# EAGLE design mm_legend_v2 (EAGLE 7.2.0)
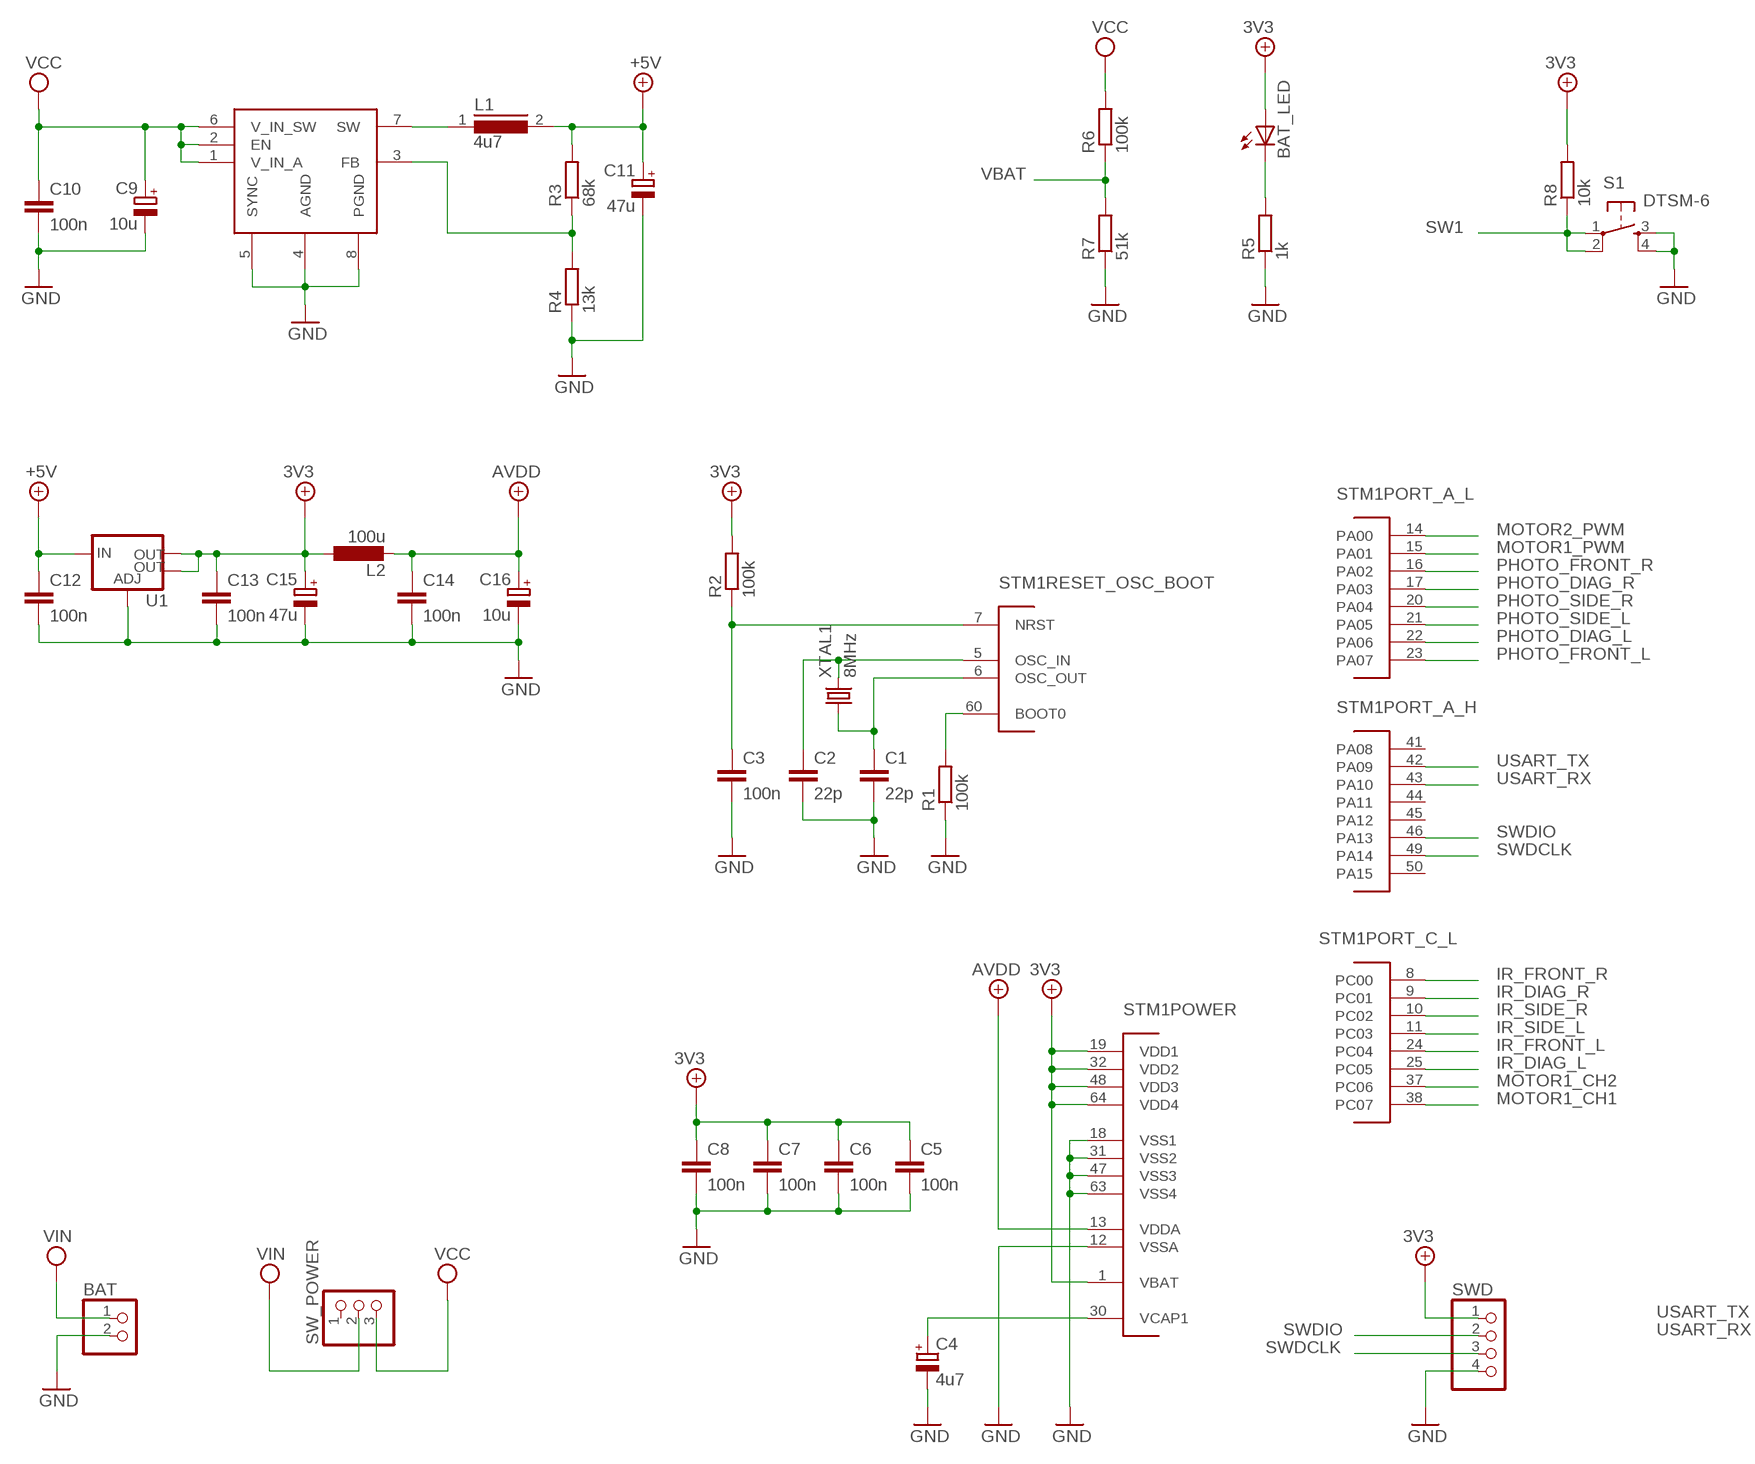
[diagram p0: schematic, sheet 1, part 1 of 2]
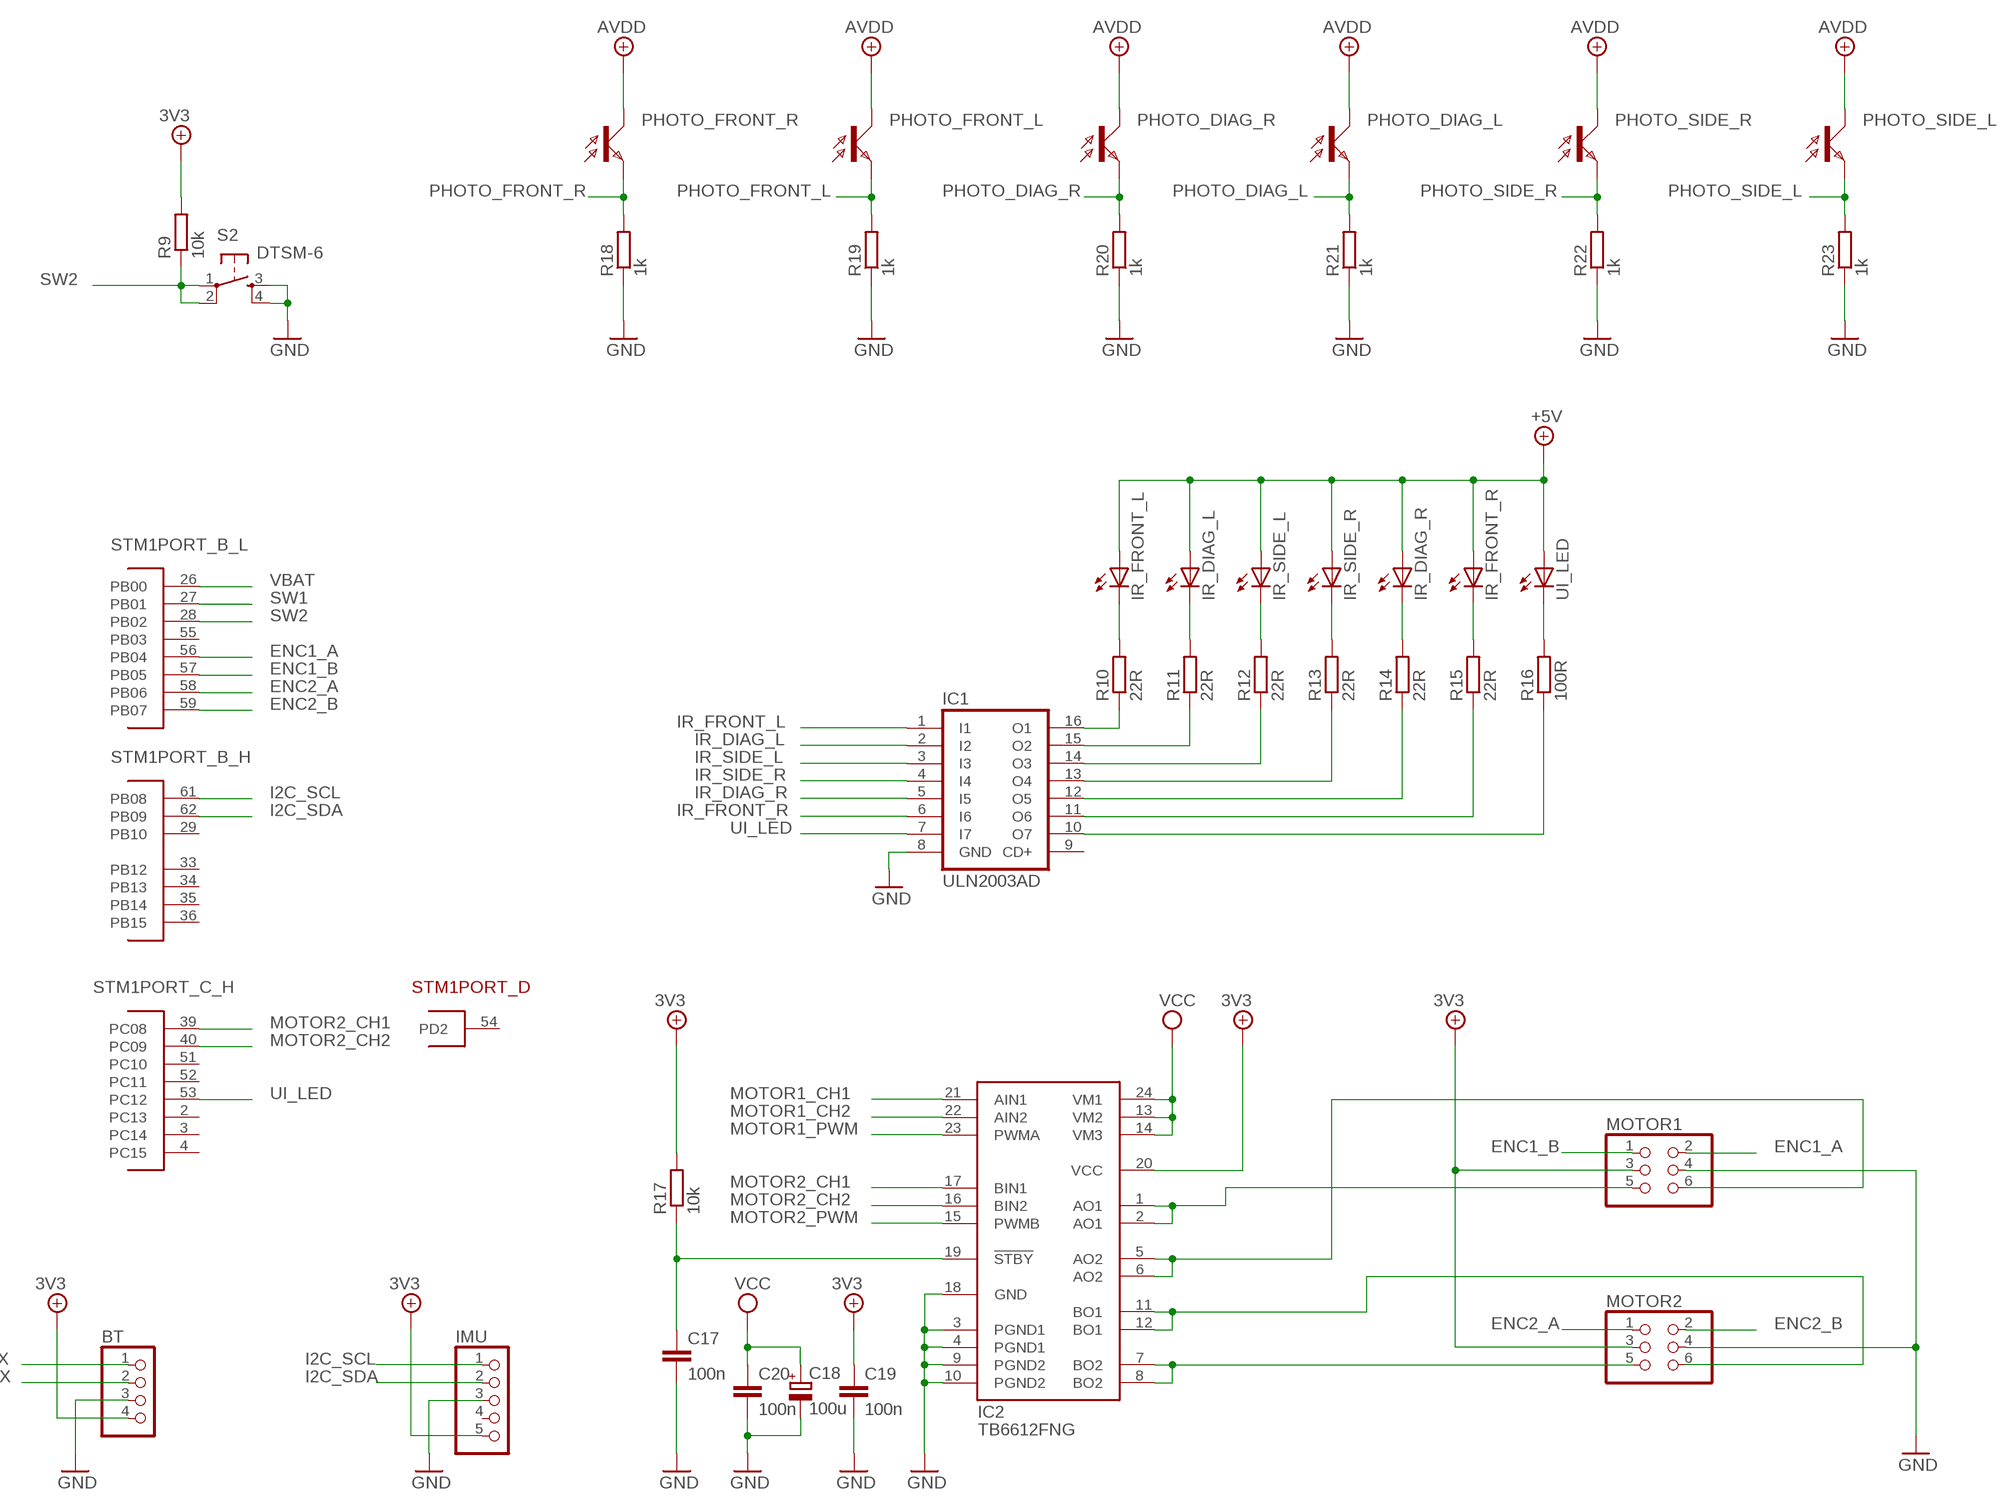
[diagram p1: schematic, sheet 1, part 2 of 2]

## Parts
BAT  PINHD-1X2  [1X02]
BAT_LED  LEDCHIP-LED0805  [CHIP-LED0805]
BT  PINHD-1X4  [1X04]
C1  22p  C-EUC0805K  [C0805K]
C2  22p  C-EUC0805K  [C0805K]
C3  100n  C-EUC0805K  [C0805K]
C4  4u7  CPOL-EUA/3216-18R  [A/3216-18R]
C5  100n  C-EUC0805K  [C0805K]
C6  100n  C-EUC0805K  [C0805K]
C7  100n  C-EUC0805K  [C0805K]
C8  100n  C-EUC0805K  [C0805K]
C9  10u  CPOL-EUA/3216-18R  [A/3216-18R]
C10  100n  C-EUC0805K  [C0805K]
C11  47u  CPOL-EUB/3528-21W  [B/3528-21W]
C12  100n  C-EUC0805K  [C0805K]
C13  100n  C-EUC0805K  [C0805K]
C14  100n  C-EUC0805K  [C0805K]
C15  47u  CPOL-EUB/3528-21W  [B/3528-21W]
C16  10u  CPOL-EUA/3216-18R  [A/3216-18R]
C17  100n  C-EUC0805K  [C0805K]
C18  100u  CPOL-EUC/6032-28R  [C/6032-28R]
C19  100n  C-EUC0805K  [C0805K]
C20  100n  C-EUC0805K  [C0805K]
IC1  ULN2003AD  [SO16]
IC2  TB6612FNG  [SSOP24]
IMU  PINHD-1X5  [1X05]
IR_DIAG_L  LED5MM  [LED5MM]
IR_DIAG_R  LED5MM  [LED5MM]
IR_FRONT_L  LED5MM  [LED5MM]
IR_FRONT_R  LED5MM  [LED5MM]
IR_SIDE_L  LED5MM  [LED5MM]
IR_SIDE_R  LED5MM  [LED5MM]
L1  4u7  DR74  [DR74]
L2  100u  L-EUL1812  [L1812]
MOTOR1  PINHD-2X3  [2X03]
MOTOR2  PINHD-2X3  [2X03]
PHOTO_DIAG_L  PHOTO_TRANSISTOR_5MM  [5MM]
PHOTO_DIAG_R  PHOTO_TRANSISTOR_5MM  [5MM]
PHOTO_FRONT_L  PHOTO_TRANSISTOR_5MM  [5MM]
PHOTO_FRONT_R  PHOTO_TRANSISTOR_5MM  [5MM]
PHOTO_SIDE_L  PHOTO_TRANSISTOR_5MM  [5MM]
PHOTO_SIDE_R  PHOTO_TRANSISTOR_5MM  [5MM]
R1  100k  R-EU_R0805W  [R0805W]
R2  100k  R-EU_R0805W  [R0805W]
R3  68k  R-EU_R0805W  [R0805W]
R4  13k  R-EU_R0805W  [R0805W]
R5  1k  R-EU_R0805W  [R0805W]
R6  100k  R-EU_R0805W  [R0805W]
R7  51k  R-EU_R0805W  [R0805W]
R8  10k  R-EU_R0805W  [R0805W]
R9  10k  R-EU_R0805W  [R0805W]
R10  22R  R-EU_R0805W  [R0805W]
R11  22R  R-EU_R0805W  [R0805W]
R12  22R  R-EU_R0805W  [R0805W]
R13  22R  R-EU_R0805W  [R0805W]
R14  22R  R-EU_R0805W  [R0805W]
R15  22R  R-EU_R0805W  [R0805W]
R16  100R  R-EU_R0805W  [R0805W]
R17  10k  R-EU_R0805W  [R0805W]
R18  1k  R-EU_R0805W  [R0805W]
R19  1k  R-EU_R0805W  [R0805W]
R20  1k  R-EU_R0805W  [R0805W]
R21  1k  R-EU_R0805W  [R0805W]
R22  1k  R-EU_R0805W  [R0805W]
R23  1k  R-EU_R0805W  [R0805W]
S1  DTSM-6  [DTSM-6]
S2  DTSM-6  [DTSM-6]
STM1  STM32F401RB  [LQFP64]
SW_POWER  PINHD-1X3  [1X03]
SWD  PINHD-1X4  [1X04]
U1  V_REG_LM1117SOT223  [SOT223]
U$2  ST1S10PHR  [SO8]
UI_LED  LEDCHIP-LED0805  [CHIP-LED0805]
XTAL1  8MHz  XTAL_SMD_50X32  [SMD_50X32]

## Nets
3V3: BAT_LED.A BT.4 C5.1 C6.1 C7.1 C8.1 C13.1 C15.+ C19.1 IC2.20(VCC) IMU.5 L2.1 MOTOR1.3 MOTOR2.3 R2.2 R8.2 R9.2 R17.2 STM1.1(POWER:VBAT) STM1.19(POWER:VDD1) STM1.32(POWER:VDD2) STM1.48(POWER:VDD3) STM1.64(POWER:VDD4) SWD.1 U1.2(OUT) U1.4(OUT)
+5V: C11.+ C12.1 IR_DIAG_L.A IR_DIAG_R.A IR_FRONT_L.A IR_FRONT_R.A IR_SIDE_L.A IR_SIDE_R.A L1.2 R3.2 U1.3(IN) UI_LED.A
AVDD: C14.1 C16.+ L2.2 PHOTO_DIAG_L.C PHOTO_DIAG_R.C PHOTO_FRONT_L.C PHOTO_FRONT_R.C PHOTO_SIDE_L.C PHOTO_SIDE_R.C STM1.13(POWER:VDDA)
ENC1_A: MOTOR1.2 STM1.56(PORT_B_L:PB04)
ENC1_B: MOTOR1.1 STM1.57(PORT_B_L:PB05)
ENC2_A: MOTOR2.1 STM1.58(PORT_B_L:PB06)
ENC2_B: MOTOR2.2 STM1.59(PORT_B_L:PB07)
GND: BAT.2 BT.3 C1.2 C2.2 C3.2 C4.- C5.2 C6.2 C7.2 C8.2 C9.- C10.2 C11.- C12.2 C13.2 C14.2 C15.- C16.- C17.2 C18.- C19.2 C20.2 IC1.8(GND) IC2.3(PGND1) IC2.4(PGND1) IC2.9(PGND2) IC2.10(PGND2) IC2.18(GND) IMU.3 MOTOR1.4 MOTOR2.4 R1.1 R4.1 R5.1 R7.1 R18.1 R19.1 R20.1 R21.1 R22.1 R23.1 S1.3 S1.4 S2.3 S2.4 STM1.12(POWER:VSSA) STM1.18(POWER:VSS1) STM1.31(POWER:VSS2) STM1.47(POWER:VSS3) STM1.63(POWER:VSS4) SWD.4 U1.1(ADJ) U$2.4(AGND) U$2.5(SYNC) U$2.8(PGND)
I2C_SCL: IMU.1 STM1.61(PORT_B_H:PB08)
I2C_SDA: IMU.2 STM1.62(PORT_B_H:PB09)
IR_DIAG_L: IC1.2(I2) STM1.25(PORT_C_L:PC05)
IR_DIAG_R: IC1.5(I5) STM1.9(PORT_C_L:PC01)
IR_FRONT_L: IC1.1(I1) STM1.24(PORT_C_L:PC04)
IR_FRONT_R: IC1.6(I6) STM1.8(PORT_C_L:PC00)
IR_SIDE_L: IC1.3(I3) STM1.11(PORT_C_L:PC03)
IR_SIDE_R: IC1.4(I4) STM1.10(PORT_C_L:PC02)
MOTOR1_CH1: IC2.21(AIN1) STM1.38(PORT_C_L:PC07)
MOTOR1_CH2: IC2.22(AIN2) STM1.37(PORT_C_L:PC06)
MOTOR1_PWM: IC2.23(PWMA) STM1.15(PORT_A_L:PA01)
MOTOR2_CH1: IC2.17(BIN1) STM1.39(PORT_C_H:PC08)
MOTOR2_CH2: IC2.16(BIN2) STM1.40(PORT_C_H:PC09)
MOTOR2_PWM: IC2.15(PWMB) STM1.14(PORT_A_L:PA00)
N$1: R1.2 STM1.60(RESET_OSC_BOOT:BOOT0)
N$2: C3.1 R2.1 STM1.7(RESET_OSC_BOOT:NRST)
N$3: C1.1 STM1.6(RESET_OSC_BOOT:OSC_OUT) XTAL1.1
N$4: C2.1 STM1.5(RESET_OSC_BOOT:OSC_IN) XTAL1.2
N$5: BAT_LED.C R5.2
N$6: C17.1 IC2.19(!STBY) R17.1
N$7: R16.2 UI_LED.C
N$8: IR_FRONT_L.K(C) R10.2
N$9: C4.+ STM1.30(POWER:VCAP1)
N$10: IR_DIAG_L.K(C) R11.2
N$11: IR_SIDE_L.K(C) R12.2
N$12: IR_SIDE_R.K(C) R13.2
N$13: IR_DIAG_R.K(C) R14.2
N$14: IR_FRONT_R.K(C) R15.2
N$15: IC1.16(O1) R10.1
N$16: IC1.15(O2) R11.1
N$17: IC1.14(O3) R12.1
N$18: IC1.13(O4) R13.1
N$19: IC1.12(O5) R14.1
N$20: IC1.11(O6) R15.1
N$21: IC1.10(O7) R16.1
N$22: L1.1 U$2.7(SW)
N$23: IC2.1(AO1) IC2.2(AO1) MOTOR1.5
N$24: IC2.5(AO2) IC2.6(AO2) MOTOR1.6
N$25: R3.1 R4.2 U$2.3(FB)
N$28: IC2.11(BO1) IC2.12(BO1) MOTOR2.6
N$30: IC2.7(BO2) IC2.8(BO2) MOTOR2.5
PHOTO_DIAG_L: PHOTO_DIAG_L.E R21.2 STM1.22(PORT_A_L:PA06)
PHOTO_DIAG_R: PHOTO_DIAG_R.E R20.2 STM1.17(PORT_A_L:PA03)
PHOTO_FRONT_L: PHOTO_FRONT_L.E R19.2 STM1.23(PORT_A_L:PA07)
PHOTO_FRONT_R: PHOTO_FRONT_R.E R18.2 STM1.16(PORT_A_L:PA02)
PHOTO_SIDE_L: PHOTO_SIDE_L.E R23.2 STM1.21(PORT_A_L:PA05)
PHOTO_SIDE_R: PHOTO_SIDE_R.E R22.2 STM1.20(PORT_A_L:PA04)
SW1: R8.1 S1.1 S1.2 STM1.27(PORT_B_L:PB01)
SW2: R9.1 S2.1 S2.2 STM1.28(PORT_B_L:PB02)
SWDCLK: STM1.49(PORT_A_H:PA14) SWD.3
SWDIO: STM1.46(PORT_A_H:PA13) SWD.2
UI_LED: IC1.7(I7) STM1.53(PORT_C_H:PC12)
USART_RX: BT.2 STM1.43(PORT_A_H:PA10)
USART_TX: BT.1 STM1.42(PORT_A_H:PA09)
VBAT: R6.1 R7.2 STM1.26(PORT_B_L:PB00)
VCC: C9.+ C10.1 C18.+ C20.1 IC2.13(VM2) IC2.14(VM3) IC2.24(VM1) R6.2 SW_POWER.3 U$2.1(V_IN_A) U$2.2(EN) U$2.6(V_IN_SW)
VEE: BAT.1 SW_POWER.2 ; supply symbol labelled VIN
Unconnected: IC1.9(CD+) IMU.4 STM1.2(PORT_C_H:PC13) STM1.3(PORT_C_H:PC14) STM1.4(PORT_C_H:PC15) STM1.29(PORT_B_H:PB10) STM1.33(PORT_B_H:PB12) STM1.34(PORT_B_H:PB13) STM1.35(PORT_B_H:PB14) STM1.36(PORT_B_H:PB15) STM1.41(PORT_A_H:PA08) STM1.44(PORT_A_H:PA11) STM1.45(PORT_A_H:PA12) STM1.50(PORT_A_H:PA15) STM1.51(PORT_C_H:PC10) STM1.52(PORT_C_H:PC11) STM1.54(PORT_D:PD2) STM1.55(PORT_B_L:PB03) SW_POWER.1

## Library data of the parts
BAT = pinhead:PINHD-1X2: PIN HEADER
BAT_LED IR_DIAG_L IR_DIAG_R IR_FRONT_L IR_FRONT_R IR_SIDE_L IR_SIDE_R UI_LED = led:LED: LED OSRAM: - CHIPLED LG R971, LG N971, LY N971, LG Q971, LY Q971, LO R971, LY R971 LH N974, LH R974 LS Q976, LO Q976, LY Q976 LO Q996 - Hyper CHIPLED LW Q18S LB Q993, LB Q99A, LB R99A - SideLED LS A670, LO A670, LY A670, LG A670, LP A670 LB A673, LV A673, LT A673, LW A673 LH A674 LY A675 LS A676, LA A676, LO A676, LY A676, LW A676 LS A679, LY A679, LG A679 - Hyper Micro SIDELED® LS Y876, LA Y876, LO Y876, LY Y876 LT Y87S - SmartLED LW L88C, LW L88S LB L89C, LB L89S, LG L890 LS L89K, LO L89K, LY L89K LS L896, LA L896, LO L896, LY L896 - TOPLED LS T670, LO T670, LY T670, LG T670, LP T670 LSG T670, LSP T670, LSY T670, LOP T670, LYG T670 LG T671, LOG T671, LSG T671 LB T673, LV T673, LT T673, LW T673 LH T674 LS T676, LA T676, LO T676, LY T676, LB T676, LH T676, LSB T676, LW T676 LB T67C, LV T67C, LT T67C, LS T67K, LO T67K, LY T67K, LW E67C LS E67B, LA E67B, LO E67B, LY E67B, LB E67C, LV E67C, LT E67C LW T67C LS T679, LY T679, LG T679 LS T770, LO T770, LY T770, LG T770, LP T770 LB T773, LV T773, LT T773, LW T773 LH T774 LS E675, LA E675, LY E675, LS T675 LS T776, LA T776, LO T776, LY T776, LB T776 LHGB T686 LT T68C, LB T68C - Hyper Mini TOPLED® LB M676 - Mini TOPLED Santana® LG M470 LS M47K, LO M47K, LY M47K Source: http://www.osram.convergy.de LUXEON: - LUMILED® LXK2-PW12-R00, LXK2-PW12-S00, LXK2-PW14-U00, LXK2-PW14-V00 LXK2-PM12-R00, LXK2-PM12-S00, LXK2-PM14-U00 LXK2-PE12-Q00, LXK2-PE12-R00, LXK2-PE12-S00, LXK2-PE14-T00, LXK2-PE14-U00 LXK2-PB12-K00, LXK2-PB12-L00, LXK2-PB12-M00, LXK2-PB14-N00, LXK2-PB14-P00, LXK2-PB14-Q00 LXK2-PR12-L00, LXK2-PR12-M00, LXK2-PR14-Q00, LXK2-PR14-R00 LXK2-PD12-Q00, LXK2-PD12-R00, LXK2-PD12-S00 LXK2-PH12-R00, LXK2-PH12-S00 LXK2-PL12-P00, LXK2-PL12-Q00, LXK2-PL12-R00 Source: www.luxeon.com KINGBRIGHT: KA-3528ASYC Source: www.kingbright.com
BT SWD = pinhead:PINHD-1X4: PIN HEADER
C1-C3 C5-C8 C10 C12-C14 C17 C19 C20 = resistor:C-EU: CAPACITOR, European symbol
C4 C9 C11 C15 C16 C18 = resistor:CPOL-EU: POLARIZED CAPACITOR, European symbol
IC1 = uln-udn:ULN2003A: DRIVER ARRAY
IC2 = tb6612:TB6612FNG
IMU = pinhead:PINHD-1X5: PIN HEADER
L1 = inductors:DR74: High Power Density, High Efficiency, Shielded Inductors Source: coiltronics_dr_series.pdf
L2 = resistor:L-EU: INDUCTOR, European symbol
MOTOR1 MOTOR2 = pinhead:PINHD-2X3: PIN HEADER
PHOTO_DIAG_L PHOTO_DIAG_R PHOTO_FRONT_L PHOTO_FRONT_R PHOTO_SIDE_L PHOTO_SIDE_R = photo_transistor_5mm:PHOTO_TRANSISTOR_5MM
R1-R23 = resistor:R-EU_: RESISTOR, European symbol
S1 S2 = switch-tact:DTSM-6
STM1 = stm32f4:STM32F401RB: STM32F401RB STM32F4 MCU with Cortex-M4 core and FPU, 128kB Flash, 64kB RAM, max clock frequency 84MHz Features: 7x General purpose timer 1x Advanced control timer 3x SPI 2x I2S 3x I2C 3x USART 1x SDIO 1x USB OTG 1x ADC Data sheet <http://www.st.com/st-web-ui/static/active/en/resource/technical/document/datasheet/DM00086815.pdf>
SW_POWER = pinhead:PINHD-1X3: PIN HEADER
U1 = SparkFun-PowerIC:V_REG_LM1117: Voltage Regulator LM1117 Standard adjustable voltage regulator but in SMD form. Spark Fun Electronics SKU : COM-00595; PROD_ID: VREG-08170
U$2 = ST1S10PHR:ST1S10PHR: ST1S10 - SO8: 3 A, 900 kHz, monolithic synchronous step-down regulator
XTAL1 = xtal_smd:XTAL_SMD_50X32

## Board
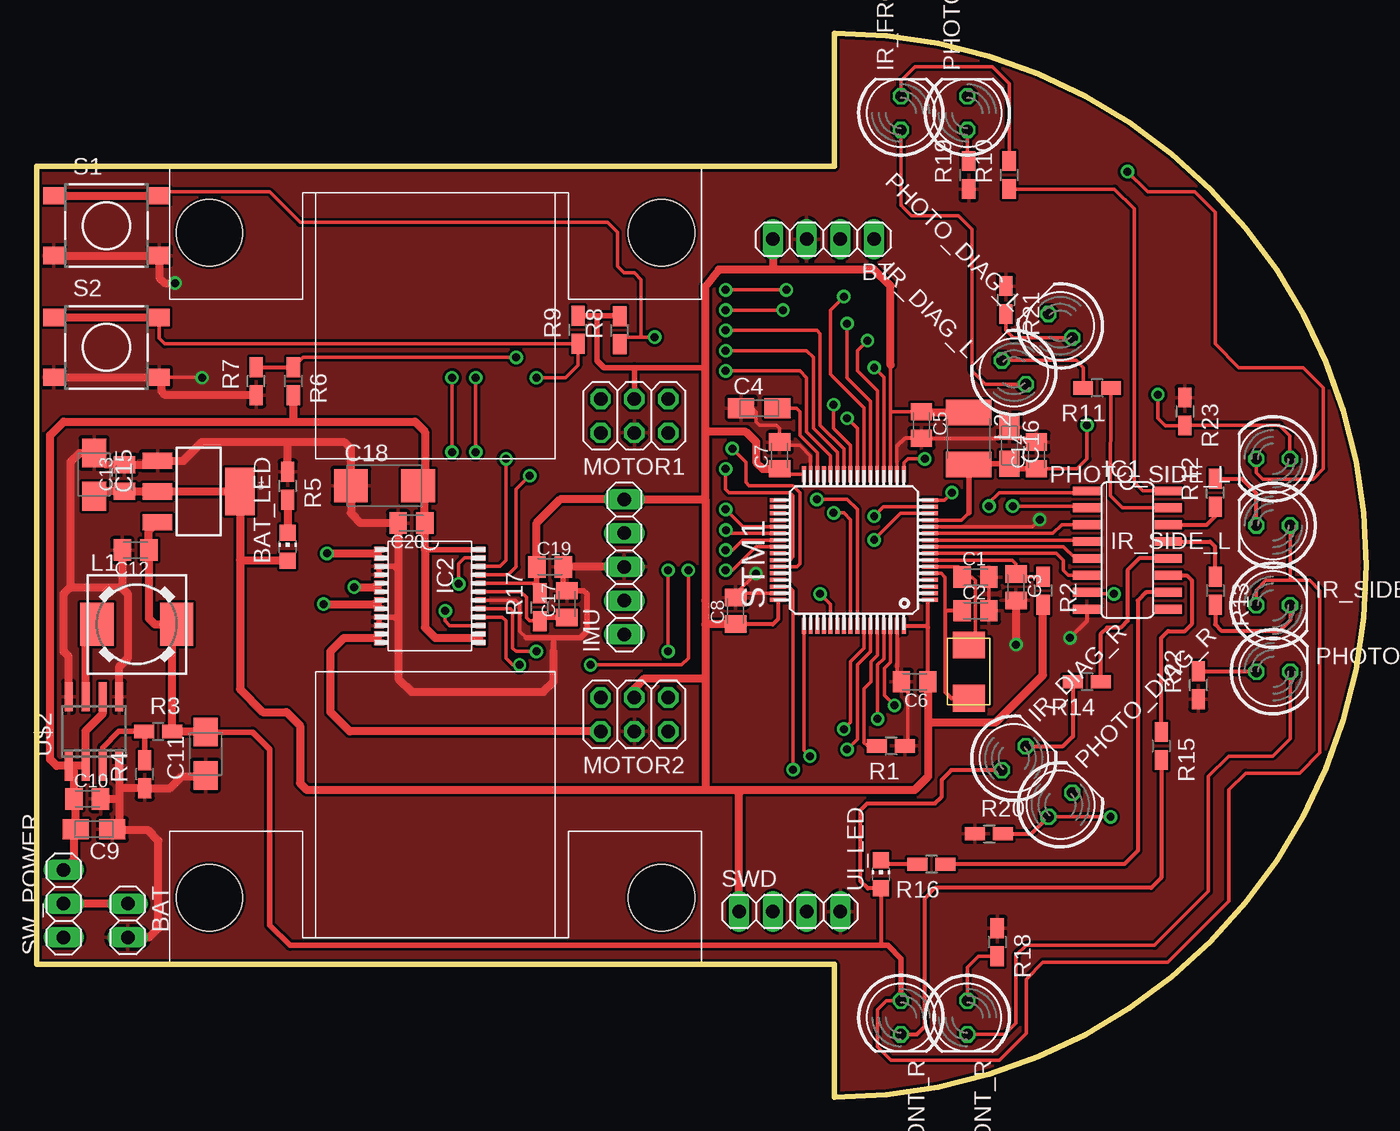
[diagram p2: board, top side]
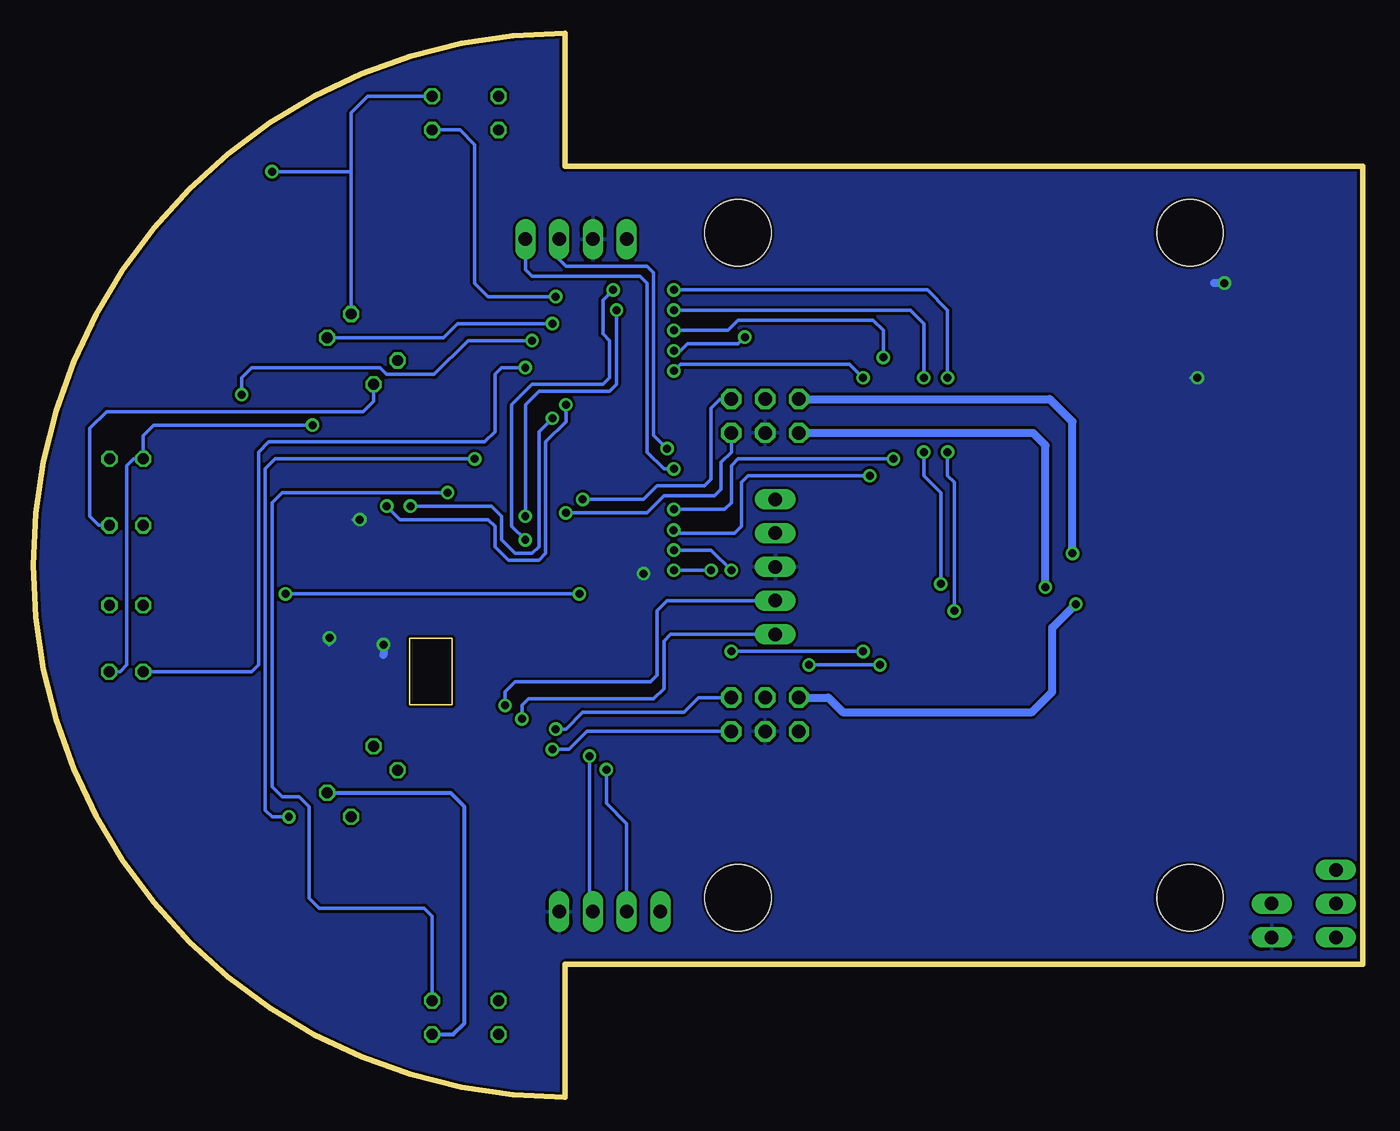
[diagram p3: board, bottom side, seen from below]

Size 100 x 80 mm. Coordinates in mm from the lower left corner, seen from the top.
Outline: 0,10 60,10 60,0 arc180 60,80 60,70 0,70 0,10
Copper layers (1*16): Top 0.035mm / dielectric 1.5mm / Bottom 0.035mm
Design rules "satland": minimum track width 8mil, minimum drill 0.3mm, track to track 8mil, track to pad 8mil, pad to pad 8mil, via to via 8mil, smd to smd 8mil, copper to edge 8mil, drill to drill 8mil, minimum pad ring 8mil, minimum via ring 8mil, stop-mask expansion 4mil, vias tented up to drill 0mil, thermal gap 10mil

### Footprints (pad centres in the part's own frame; a part is rotated, then mirrored left to right if it is on the bottom)
1X02 = drill 1.016 long: 1 -1.27,0; 2 1.27,0
CHIP-LED0805 = smd 1.2 x 1.2: A 0,-1.05; C 0,1.05
1X04 = drill 1.016 long: 1 -3.81,0; 2 -1.27,0; 3 1.27,0; 4 3.81,0
C0805K = smd 1.3 x 1.6: 1 -1,0; 2 1,0
A/3216-18R = smd 1.95 x 1.5: + 1.375,0; - -1.375,0
B/3528-21W = smd 2.15 x 1.8: + 1.625,0; - -1.625,0
C/6032-28R = smd 2.55 x 2.5: + 2.525,0; - -2.525,0
SO16 = smd 0.66 x 2.032: 1 -4.445,-3.073; 2 -3.175,-3.073; 3 -1.905,-3.073; 4 -0.635,-3.073; 5 0.635,-3.073; 6 1.905,-3.073; 7 3.175,-3.073; 8 4.445,-3.073; 9 4.445,3.073; 10 3.175,3.073; 11 1.905,3.073; 12 0.635,3.073; 13 -0.635,3.073; 14 -1.905,3.073; 15 -3.175,3.073; 16 -4.445,3.073
SSOP24 = smd 0.406 x 0.762: 1 -3.651,-3.81; 2 -3.016,-3.81; 3 -2.381,-3.81; 4 -1.746,-3.81; 5 -1.111,-3.81; 6 -0.476,-3.81; 7 0.159,-3.81; 8 0.794,-3.81; 9 1.429,-3.81; 10 2.064,-3.81; 11 2.699,-3.81; 12 3.334,-3.81; 13 3.334,3.81; 14 2.699,3.81; 15 2.064,3.81; 16 1.429,3.81; 17 0.794,3.81; 18 0.159,3.81; 19 -0.476,3.81; 20 -1.111,3.81; 21 -1.746,3.81; 22 -2.381,3.81; 23 -3.016,3.81; 24 -3.651,3.81
1X05 = drill 1.016 long: 1 -5.08,0; 2 -2.54,0; 3 0,0; 4 2.54,0; 5 5.08,0
LED5MM = drill 0.813 octagon: A -1.27,0; K 1.27,0
DR74 = smd 2.5 x 3.25: 1 -3,0; 2 3,0
L1812 = smd 1.9 x 3.4: 1 -1.95,0; 2 1.95,0
2X03 = drill 1.016 octagon: 1 -2.54,-1.27; 2 -2.54,1.27; 3 0,-1.27; 4 0,1.27; 5 2.54,-1.27; 6 2.54,1.27
5MM = drill 0.813 octagon: C 1.27,0; E -1.27,0
R0805W = smd 1.5 x 1: 1 -1.052,0; 2 1.052,0
DTSM-6 = smd 1.55 x 1.3: 1 -3.975,2.25; 2 3.975,2.25; 3 -3.975,-2.25; 4 3.975,-2.25
LQFP64 = smd 0.3 x 1.2: 1 -3.75,-5.7; 2 -3.25,-5.7; 3 -2.75,-5.7; 4 -2.25,-5.7; 5 -1.75,-5.7; 6 -1.25,-5.7; 7 -0.75,-5.7; 8 -0.25,-5.7; 9 0.25,-5.7; 10 0.75,-5.7; 11 1.25,-5.7; 12 1.75,-5.7; 13 2.25,-5.7; 14 2.75,-5.7; 15 3.25,-5.7; 16 3.75,-5.7; 33 3.75,5.7; 34 3.25,5.7; 35 2.75,5.7; 36 2.25,5.7; 37 1.75,5.7; 38 1.25,5.7; 39 0.75,5.7; 40 0.25,5.7; 41 -0.25,5.7; 42 -0.75,5.7; 43 -1.25,5.7; 44 -1.75,5.7; 45 -2.25,5.7; 46 -2.75,5.7; 47 -3.25,5.7; 48 -3.75,5.7 | smd 1.2 x 0.3: 17 5.7,-3.75; 18 5.7,-3.25; 19 5.7,-2.75; 20 5.7,-2.25; 21 5.7,-1.75; 22 5.7,-1.25; 23 5.7,-0.75; 24 5.7,-0.25; 25 5.7,0.25; 26 5.7,0.75; 27 5.7,1.25; 28 5.7,1.75; 29 5.7,2.25; 30 5.7,2.75; 31 5.7,3.25; 32 5.7,3.75; 49 -5.7,3.75; 50 -5.7,3.25; 51 -5.7,2.75; 52 -5.7,2.25; 53 -5.7,1.75; 54 -5.7,1.25; 55 -5.7,0.75; 56 -5.7,0.25; 57 -5.7,-0.25; 58 -5.7,-0.75; 59 -5.7,-1.25; 60 -5.7,-1.75; 61 -5.7,-2.25; 62 -5.7,-2.75; 63 -5.7,-3.25; 64 -5.7,-3.75
1X03 = drill 1.016 long: 1 -2.54,0; 2 0,0; 3 2.54,0
SOT223 = smd 1.219 x 2.235: 1 -2.311,-3.099; 2 0,-3.099; 3 2.311,-3.099 | smd 3.6 x 2.2: 4 0,3.099
MOTOR_HOLDER = hole 5: -17,5; 17,5
SO8 = smd 0.6 x 2.2: 1 -1.905,-2.6; 2 -0.635,-2.6; 3 0.635,-2.6; 4 1.905,-2.6; 5 1.905,2.6; 6 0.635,2.6; 7 -0.635,2.6; 8 -1.905,2.6
SMD_50X32 = smd 2 x 2.4: 1 -2,0; 2 2,0

### Placement (x,y rotation side)
BAT  6.86,13.29 270 top
BAT_LED  18.88,41.4 0 top
BT  59.18,64.52 180 top
C1  70.61,39.12 0 top
C2  70.61,36.58 0 top
C3  73.66,38.35 270 top
C4  54.36,51.82 0 top
C5  66.55,50.55 270 top
C6  66.04,31.24 180 top
C7  55.88,48.26 90 top
C8  52.58,36.58 90 top
C9  4.32,20.15 180 top
C10  3.81,22.43 0 top
C11  12.7,25.83 90 top
C12  7.45,41.15 180 top
C13  6.6,46.56 90 top
C14  75.18,48.26 90 top
C15  4.32,46.82 270 top
C16  73.15,49.02 270 top
C17  39.88,37.08 90 top
C18  26.16,45.97 0 top
C19  38.61,39.88 0 top
C20  28.19,43.18 180 top
IC1  82.04,41.15 270 top
IC2  29.58,37.54 270 top
IMU  44.2,39.88 90 top
IR_DIAG_L  73.5,54.5 135 top
IR_DIAG_R  73.5,25.5 45 top
IR_FRONT_L  65,74 90 top
IR_FRONT_R  65,6 270 top
IR_SIDE_L  93,43 180 top
IR_SIDE_R  93,37 0 top
L1  7.54,35.56 0 top
L2  70.1,49.53 270 top
MOTOR1  44.96,51.23 180 top
MOTOR2  44.96,28.78 180 top
PHOTO_DIAG_L  76.99,58 135 top
PHOTO_DIAG_R  77,22 45 top
PHOTO_FRONT_L  70,74 90 top
PHOTO_FRONT_R  70,6 270 top
PHOTO_SIDE_L  92.99,48 180 top
PHOTO_SIDE_R  93.01,32 0 top
R1  64.26,26.42 180 top
R2  75.69,38.1 270 top
R3  9.14,27.51 0 top
R4  8.13,24.3 90 top
R5  18.88,45.97 270 top
R6  19.3,53.85 270 top
R7  16.51,53.85 90 top
R8  43.86,57.66 90 top
R9  40.71,57.71 90 top
R10  73.15,69.34 90 top
R11  79.76,53.34 180 top
R12  88.65,45.47 90 top
R13  88.65,38.1 270 top
R14  78.99,31.24 180 top
R15  84.58,26.42 270 top
R16  67.31,17.53 180 top
R17  37.85,36.83 90 top
R18  72.25,11.67 270 top
R19  70.1,69.34 90 top
R20  71.63,19.81 0 top
R21  72.9,59.94 270 top
R22  87.38,30.99 90 top
R23  86.36,51.56 270 top
S1  5.25,65.53 0 top
S2  5.25,56.39 0 top
STM1  61.47,41.15 90 top
SW_POWER  2.03,14.56 90 top
SWD  56.64,13.97 0 top
U1  12.19,45.55 270 top
U$1  [MOTOR_HOLDER]  30,10 0 top
U$2  4.32,27.51 0 top
U$3  [MOTOR_HOLDER]  30,70 180 top
UI_LED  63.5,16.76 0 top
XTAL1  70.1,32 270 top

### Tracks (layer width: path | path; a pad name or v marks a point on that pad's centre or on a via)
3V3
  Top 0.254: IC2.20 37.57,38.65 | STM1.32 56.29,46.85 C7.1 | STM1.19 64.22,51.56 | 64.22,51.56 64.22,55.07 | C5.1 64.23,51.55 64.22,51.56
  Top 0.305: 50.35,37.4 50.29,37.34 | C6.1 67.04,35.31 | 67.04,35.31 67.04,37.27 STM1.1 | STM1.64 66.9,35.45 67.04,35.31 | STM1.48 55.77,35.96 55.37,35.56 52.59,35.56 C8.1
  Top 0.406: C19.1 37.61,38.61 | 37.61,38.61 37.61,38.12 R17.2 | 37.57,38.65 37.61,38.61 | 43.81,58.76 R8.2 43.86,58.76 42.16,58.76 | R9.2 42.16,58.76 | 42.16,58.76 42.16,55.37 42.67,54.86 44.96,54.86 | 44.96,54.86 50.29,54.86 | MOTOR1.3 44.96,54.86
  Top 0.61: C15.+ 4.69,45.56 C13.1 9.08,45.56 U1.2 U1.4 15.29,40.39 | 15.29,40.39 15.29,30.68 17.02,28.96 18.8,28.96 19.81,27.94 19.81,23.62 20.32,23.11 50.29,23.11 | 50.29,23.11 52.58,23.11 | 52.58,23.11 66.04,23.11 67.04,24.11 67.04,28.19 | 50.29,44.96 50.29,37.34 50.29,35.56 | 50.29,35.56 50.29,31.5 | 50.29,31.5 50.29,23.11 | 50.29,44.96 IMU.5 39.37,44.96 37.61,43.2 C19.1 | C6.1 67.04,28.19 | L2.1 66.61,51.48 C5.1 | SWD.1 52.83,22.86 52.58,23.11 | 52.59,35.56 50.29,35.56 | 64.22,55.07 64.22,61 62.99,62.23 55.37,62.23 | 55.37,62.23 51.31,62.23 50.29,60.96 50.29,54.86 50.29,50.04 | 50.29,44.96 50.29,50.04 | 50.29,50.04 53.34,50.04 54.1,49.28 54.1,47.75 54.61,47.24 55.86,47.24 C7.1 | BAT_LED.A 15.32,40.35 15.29,40.39 | BT.4 55.37,62.23 | MOTOR2.3 44.96,30.73 45.72,31.5 50.29,31.5 | 67.04,28.19 72.14,28.19 75.69,31.75 R2.2
+5V
  Top 0.254: IR_SIDE_R.A 91.73,38.14 92.46,38.86 94.23,38.86 | 94.23,38.86 95.76,38.86 96.52,38.1 96.52,25.91 95,24.38 90.93,24.38 89.66,23.11 89.66,14.73 85.09,10.16 75.69,10.16 74.42,8.89 74.42,4.83 72.39,2.79 64.26,2.79 63.25,3.81 63.25,6.6 63.91,7.27 IR_FRONT_R.A | IR_SIDE_L.A 94.27,38.9 94.23,38.86 | IR_DIAG_L.A 71.37,53.6 70.36,54.61 70.36,65.28 69.34,66.29 65.79,66.29 65.15,66.93 65.02,67.06 65,67.08 IR_FRONT_L.A
  Top 0.305: 63.5,11.43 UI_LED.A 62.52,15.71 61.98,16.26 61.98,21.59 62.48,22.1 67.56,22.1 68.07,22.61 68.07,23.88 68.8,24.6 IR_DIAG_R.A
  Top 0.406: C11.+ 16.23,27.45 17.53,26.16 17.53,12.95 19.05,11.43 63.5,11.43 64.01,11.43 65,10.44 IR_FRONT_R.A
  Top 0.61: U1.3 8.45,42.59 C12.1 8.45,36 8.89,35.56 L1.2 10.2,35.22 R3.2 12.64,27.51 C11.+
  Bottom 0.254: IR_SIDE_L.A 95.07,43 95.76,43.69 95.76,50.29 94.49,51.56 75.18,51.56 74.4,52.35 IR_DIAG_L.A
AVDD  (via drill 0.6)
  Top 0.254: STM1.13 69.56,43.4 70.1,43.94 | 74.68,47.26 74.69,47.24 78.23,47.24 78.99,48 v78.99,50.54 v78.99,50.55 | PHOTO_SIDE_R.C 94.28,26.97 92.96,25.65 89.66,25.65 88.14,24.13 88.14,15.49 84.07,11.43 74.42,11.43 73.66,10.67 73.66,5.59 72.8,4.73 PHOTO_FRONT_R.C | PHOTO_SIDE_L.C 91.72,46.96 92.2,46.48 96.01,46.48 96.77,47.24 96.77,53.34 95.25,54.86 90.42,54.86 88.65,56.64 88.65,66.55 87.12,68.07 83.57,68.07 v82.04,69.6
  Top 0.406: 70.1,43.94 L2.2 70.17,47.65 C16.+ 73.54,47.26 74.68,47.26 C14.1
  Bottom 0.254: v78.99,50.55 90.93,50.55 91.72,49.76 PHOTO_SIDE_L.C 92.46,48 92.96,47.5 92.96,32.51 93.47,32 PHOTO_SIDE_R.C | PHOTO_DIAG_L.C 76.09,69.6 | 76.09,69.6 76.09,74.02 74.84,75.27 PHOTO_FRONT_L.C | v82.04,69.6 76.09,69.6
  Bottom 0.305: PHOTO_FRONT_R.C 68.42,4.73 67.56,5.59 67.56,21.84 68.62,22.9 PHOTO_DIAG_R.C
ENC1_A  (via drill 0.6 pad 0.3)
  Top 0.254: STM1.56 61.22,43.43 60.71,43.94 v59.94,43.94
  Bottom 0.254: v59.94,43.94 53.85,43.94 52.58,45.21 48.77,45.21 48.26,45.72 48.26,47.75 47.5,48.51 MOTOR1.2
ENC1_B  (via drill 0.6 pad 0.3)
  Top 0.254: STM1.57 61.72,44.2 60.96,44.96 v58.67,44.96
  Bottom 0.254: v58.67,44.96 54.1,44.96 53.09,45.97 49.53,45.97 49.02,46.48 49.02,51.82 48.34,52.5 MOTOR1.1
ENC2_A  (via drill 0.6 pad 0.3)
  Top 0.254: STM1.58 62.22,33.77 61.21,32.77 61.21,28.19 v60.71,27.69
  Bottom 0.254: v60.71,27.69 59.94,27.69 58.67,28.96 51.05,28.96 49.96,30.05 MOTOR2.1
ENC2_B  (via drill 0.6 pad 0.3)
  Top 0.254: STM1.59 62.72,33.51 61.72,32.51 61.72,26.92 v60.96,26.16
  Bottom 0.254: v60.96,26.16 59.69,26.16 58.34,27.51 MOTOR2.2
GND  (via drill 0.6, 0.6 pad 0.3)
  Top 0.254: C1.2 71.61,37.34 | 71.61,37.34 C2.2 | 71.63,37.35 71.61,37.34 | 36.83,34.54 36.32,35.05 36.32,37.08 36.03,37.38 IC2.18 | STM1.12 74.9,42.9 v75.44,43.43 | STM1.31 58.22,48.21 57.4,49.02 56.12,49.02 C7.2 55.88,50.29 55.63,50.55 54.36,50.55 54.1,50.8 54.1,51.56 53.85,51.82 C4.- | C6.2 65.28,31.24 65.53,30.99 65.53,26.63 R1.1 | STM1.18 64.72,48.97 | v12.45,54.1 12.41,54.14 S2.4 | STM1.47 52.9,37.9 | C8.2 52.58,37.85 v54.1,39.37
  Top 0.305: STM1.63 64.72,31.56 C6.2 | 52.9,37.9 C8.2 | 64.72,48.97 65.29,49.55 C5.2 72.3,49.55 C16.- 73.15,49.78 73.41,49.53 74.93,49.53 75.18,49.28 C14.2 | IC1.8 78.97,35.79 v77.72,34.54
  Top 0.406: C19.2 39.61,38.35 C17.2 39.89,38.1 41.15,38.1 41.4,37.85 41.4,35.05 40.89,34.54 38.86,34.54 | 38.86,33.53 38.86,34.54 | IC2.4 IC2.3 26.9,39.92 27.19,39.62 | IC2.10 IC2.9 26.9,36.11 27.19,35.81 | 38.86,34.54 36.83,34.54
  Top 0.61: U$2.4 6.22,23.11 | 6.22,23.11 6.22,22.35 | 6.22,22.35 6.22,20.68 C9.- 5.77,20.07 8.38,20.07 9.14,19.3 9.14,12.7 8.46,12.02 BAT.2 | C10.2 6.14,22.43 6.22,22.35 | 6.22,23.11 6.36,23.25 R4.1 10.04,23.25 10.92,24.13 12.63,24.13 C11.- | U$2.8 2.41,33.15 2.03,33.53 2.03,37.85 2.54,38.35 | 2.54,38.35 6.35,38.35 | 6.35,38.35 6.86,37.85 6.86,33.02 6.22,32.38 U$2.5 | 2.54,38.35 2.54,47.75 3.23,48.44 C15.- 5.2,47.56 C13.2 8.8,47.56 U1.1 11.03,47.86 12.45,49.28 18.8,49.28 | C12.2 6.45,38.45 6.35,38.35 | 38.86,33.53 38.86,31.24 38.1,30.48 28.19,30.48 27.19,31.48 27.19,35.81 27.19,39.62 C20.2 24.38,43.18 23.64,43.93 C18.- 23.62,45.99 23.62,48.77 23.11,49.28 18.8,49.28 | IMU.3 C19.2 | R5.1 18.88,49.2 18.8,49.28 | S2.3 S2.4 9.4,53.97 9.4,53.09 9.69,52.8 R7.1 | S1.3 S1.4 9.23,61.64 9.65,61.21 v10.41,61.21 | C3.2 v73.66,34.04
  Bottom 0.254: v75.44,43.43 75.95,43.43 | v12.45,54.1 12.95,54.1 | v54.1,39.37 54.1,39.62
  Bottom 0.305: v77.72,34.54 77.72,34.04
  Bottom 0.61: v10.41,61.21 11.18,61.21 | v73.66,34.04 73.66,33.27
  pour Top: 0,0 0,80.01 100.08,80.01 100.08,0
  pour Bottom: 0,80.01 100.08,80.01 100.08,-0.51 0,-0.51
I2C_SCL  (via drill 0.6 pad 0.3)
  Top 0.254: STM1.61 63.72,32.98 63.25,32.51 v63.25,28.45
  Bottom 0.254: IMU.1 52.07,34.8 52.58,34.29 52.58,30.73 53.34,29.97 62.74,29.97 63.25,29.46 v63.25,28.45
I2C_SDA  (via drill 0.6 pad 0.3)
  Top 0.254: STM1.62 64.22,32.72 63.75,32.26 63.75,30.23 v64.52,29.46
  Bottom 0.254: IMU.2 52.32,37.34 53.09,36.58 53.09,31.75 53.59,31.24 63.75,31.24 64.52,30.48 v64.52,29.46
IR_DIAG_L  (via drill 0.6 pad 0.3)
  Top 0.254: 78.84,44.2 IC1.2 78.84,44.45 v73.41,44.45 | STM1.25 61.22,49.02 59.94,50.29 v59.94,52.07
  Bottom 0.254: v59.94,52.07 59.94,50.8 61.47,49.28 61.47,40.89 61.98,40.39 64.26,40.39 65.28,41.4 65.28,42.93 65.79,43.43 72.39,43.43 v73.41,44.45
IR_DIAG_R
  Top 0.254: STM1.9 77.22,41.4 78.11,40.51 IC1.5
IR_FRONT_L  (via drill 0.6 pad 0.3)
  Top 0.254: STM1.24 61.72,50.3 v60.96,51.05 | v71.63,44.45 71.63,44.7 72.39,45.47 78.84,45.47 IC1.1
  Bottom 0.254: v60.96,51.05 61.98,50.04 61.98,41.4 62.48,40.89 63.75,40.89 64.77,41.91 64.77,43.69 65.53,44.45 v71.63,44.45
IR_FRONT_R
  Top 0.254: STM1.8 76.7,40.9 77.22,40.39 77.22,39.62 77.6,39.24 IC1.6
IR_SIDE_L
  Top 0.254: STM1.11 76.43,42.4 77.09,43.05 IC1.3
IR_SIDE_R
  Top 0.254: STM1.10 78.85,41.9 IC1.4
MOTOR1_CH1  (via drill 0.6 pad 0.3)
  Top 0.254: IC2.21 35.47,39.28 36.07,39.88 36.07,45.72 v37.08,46.74 | STM1.38 52.09,42.4 v51.84,42.65
  Bottom 0.254: v51.84,42.65 51.58,42.4 47.26,42.4 46.74,42.93 46.74,46.23 46.23,46.74 v37.08,46.74
MOTOR1_CH2  (via drill 0.6 pad 0.3)
  Top 0.254: STM1.37 53.11,42.9 v51.82,44.2 | IC2.22 34.84,39.92 35.31,40.39 v35.31,48.01
  Bottom 0.254: v51.82,44.2 48.01,44.2 47.5,44.7 47.5,47.5 46.99,48.01 v35.31,48.01
MOTOR1_PWM  (via drill 0.6 pad 0.3)
  Top 0.254: STM1.15 63.7,44.4 v62.99,43.69 | v56.13,59.18 v51.82,59.18 | v33.02,54.1 v33.02,48.51 | IC2.23 32.17,40.55 31.75,40.13 v31.75,38.61
  Bottom 0.254: v62.99,43.69 62.99,52.07 61.98,53.09 56.64,53.09 56.13,53.59 v56.13,59.18 | v51.82,59.18 34.04,59.18 33.02,58.17 v33.02,54.1 | v33.02,48.51 33.02,46.74 31.75,45.47 v31.75,38.61
MOTOR2_CH1  (via drill 0.6, 0.6 pad 0.3)
  Top 0.254: IC2.17 35.65,36.74 35.81,36.58 35.81,33.78 36.07,33.53 v37.59,33.53 | v51.82,41.15 52.32,41.15 53.07,41.9 STM1.39 | v47.5,33.53 v47.5,39.62
  Bottom 0.254: v51.82,41.15 49.02,41.15 v47.5,39.62 | v37.59,33.53 v47.5,33.53
MOTOR2_CH2  (via drill 0.6 pad 0.3)
  Top 0.254: STM1.40 54.1,41.4 52.32,39.62 v51.82,39.62 | v36.32,32.51 35.81,32.51 35.31,33.02 35.31,35.81 35.01,36.11 IC2.16 | v41.66,32.51 48.51,32.51 49.02,33.02 v49.02,39.62
  Bottom 0.254: v51.82,39.62 v49.02,39.62 | v41.66,32.51 v36.32,32.51
MOTOR2_PWM  (via drill 0.6 pad 0.3)
  Top 0.254: STM1.14 64.98,43.9 v62.99,41.91 | v56.39,60.71 v51.82,60.71 | v31.24,54.1 v31.24,48.51 | IC2.15 31.08,35.47 30.73,35.81 v30.73,36.58
  Bottom 0.254: v62.99,41.91 64.01,42.93 64.01,52.07 62.48,53.59 57.15,53.59 56.64,54.1 56.64,56.9 57.15,57.4 57.15,59.94 v56.39,60.71 | v51.82,60.71 32.77,60.71 31.24,59.18 v31.24,54.1 | v31.24,48.51 31.24,46.74 30.73,46.23 v30.73,36.58
N$1
  Top 0.254: R1.2 62.48,26.42 62.23,26.67 62.23,30.73 62.74,31.24 62.74,32.77 63.22,33.25 STM1.60
N$2
  Top 0.254: STM1.7 73.39,40.4 73.66,40.13 C3.1 73.86,39.15 R2.1
N$3
  Top 0.254: C1.1 70.36,39.12 70.61,38.86 70.61,34.51 XTAL1.1 | STM1.6 69.32,39.9 69.6,39.62
  Top 0.305: 69.6,39.62 69.6,39.13 C1.1
N$4
  Top 0.254: STM1.5 68.04,39.4 68.33,39.12 68.33,36.58
  Top 0.305: XTAL1.2 68.8,30 68.33,30.48 68.33,36.58 C2.1
N$5
  Top 0.61: R5.2 BAT_LED.C
N$6
  Top 0.254: IC2.19 36.41,38.01 36.83,37.59 36.83,36.07 37.08,35.81 37.81,35.81 R17.1
  Top 0.406: C17.1 38.15,36.08 R17.1
N$7
  Top 0.305: R16.2 63.79,17.53 UI_LED.C
N$8
  Top 0.254: R10.2 73.15,76.2 71.88,77.47 66.04,77.47 65,76.43 IR_FRONT_L.K
N$9
  Top 0.254: STM1.30 58.72,48.47 57.4,49.78 57.4,51.56 57.15,51.82 C4.+ 55.98,52.07
N$10
  Top 0.254: IR_DIAG_L.K 78.21,55.4 78.74,54.86 78.74,53.38 R11.2
N$11
  Top 0.305: IR_SIDE_L.K 91.73,45.43 90.64,46.52 R12.2
N$12
  Top 0.305: IR_SIDE_R.K 94.27,35.85 93.47,35.05 89.15,35.05 88.65,35.56 R13.2
N$13
  Top 0.305: R14.2 77.94,27.14 77.2,26.4 IR_DIAG_R.K
N$14
  Top 0.305: R15.2 84.58,16.51 83.82,15.75 67.56,15.75 66.8,14.99 66.8,5.33 66.2,4.73 IR_FRONT_R.K
N$15
  Top 0.254: IC1.16 83.19,45.59 82.55,46.23 82.55,66.8 81.06,68.29 R10.1
N$16
  Top 0.254: IC1.15 81.66,44.32 80.77,45.21 R11.1
N$17
  Top 0.305: IC1.14 88.01,43.05 88.65,43.69 R12.1
N$18
  Top 0.305: IC1.13 88.27,41.78 88.65,41.4 R13.1
N$19
  Top 0.305: IC1.12 82.93,40.51 82.04,39.62 82.04,35.81 81.53,35.31 80.52,35.31 80.01,34.8 80.01,31.28 R14.1
N$20
  Top 0.305: IC1.11 86.49,39.24 86.87,38.86 86.87,35.56 86.36,35.05 85.09,35.05 84.58,34.54 R15.1
N$21
  Top 0.305: IC1.10 83.44,37.97 82.8,37.34 82.8,18.54 81.79,17.53 R16.1
N$22
  Top 0.61: U$2.7 3.68,35.18 3.81,35.31 4.29,35.31 L1.1
N$23  (via drill 0.6 pad 0.25)
  Top 0.254: 25.4,40.89 25.48,40.89 IC2.1
  Top 0.406: IC2.2 IC2.1 25.73,41.15
  Top 0.61: v21.84,40.89 25.4,40.89
  Bottom 0.61: v21.84,40.89 21.84,50.8 23.54,52.5 MOTOR1.5
N$24  (via drill 0.6 pad 0.3)
  Top 0.254: 25.4,38.35 25.48,38.35 IC2.5
  Top 0.406: IC2.5 IC2.6
  Top 0.61: v23.88,38.35 25.4,38.35
  Bottom 0.61: MOTOR1.6 24.81,49.96 23.88,49.02 v23.88,38.35
N$25
  Top 0.406: U$2.3 4.95,26.29 6.18,27.51 R3.1 8.13,27.48 R4.2
N$28
  Top 0.254: 25.4,34.54 25.48,34.54 IC2.11
  Top 0.406: IC2.12 IC2.11
  Top 0.61: MOTOR2.6 23.54,27.51 22.1,28.96 22.1,33.53 23.11,34.54 25.4,34.54
N$30  (via drill 0.6)
  Top 0.254: 25.4,37.08 25.48,37.08 IC2.7
  Top 0.406: IC2.8 IC2.7
  Top 0.61: v21.59,37.08 25.4,37.08
  Bottom 0.61: MOTOR2.5 40.21,30.05 39.12,28.96 24.89,28.96 23.37,30.48 23.37,35.31 v21.59,37.08
PHOTO_DIAG_L  (via drill 0.6)
  Top 0.254: STM1.22 62.72,52.34 60.96,54.1 v60.96,58.17 | PHOTO_DIAG_L.E 73.45,57.1 72.9,57.66 R21.2
  Bottom 0.254: v60.96,58.17 68.07,58.17 69.14,57.1 PHOTO_DIAG_L.E
PHOTO_DIAG_R  (via drill 0.6 pad 0.3)
  Top 0.254: STM1.17 65.22,47.69 65.53,48.01 v66.8,48.01 | v80.77,21.08 76.12,21.08 PHOTO_DIAG_R.E
  Top 0.305: R20.2 74.81,19.81 PHOTO_DIAG_R.E
  Bottom 0.254: v66.8,48.01 81.79,48.01 82.55,47.24 82.55,21.59 82.04,21.08 v80.77,21.08
PHOTO_FRONT_L  (via drill 0.6)
  Top 0.254: PHOTO_FRONT_L.E 70,70.5 R19.2 | STM1.23 62.22,51.83 59.69,54.36 59.69,59.18 v60.71,60.2
  Bottom 0.254: v60.71,60.2 65.79,60.2 66.8,61.21 66.8,71.63 67.9,72.73 PHOTO_FRONT_L.E
PHOTO_FRONT_R  (via drill 0.6 pad 0.3)
  Top 0.254: STM1.16 68.27,44.9 v68.83,45.47 | PHOTO_FRONT_R.E 70,9.8 70.81,10.62 R18.2
  Bottom 0.254: v68.83,45.47 81.28,45.47 82.04,44.7 82.04,23.37 81.28,22.61 80.01,22.61 79.25,21.84 79.25,14.99 78.49,14.22 70.61,14.22 70,13.61 PHOTO_FRONT_R.E
PHOTO_SIDE_L  (via drill 0.6)
  Top 0.254: STM1.21 63.22,53.11 61.72,54.61 61.72,56.13 v62.48,56.9 | v84.33,52.83 84.33,51.05 84.87,50.51 R23.2 86.4,50.55 93.47,50.55 94.26,49.76 PHOTO_SIDE_L.E
  Bottom 0.254: v62.48,56.9 67.31,56.9 69.85,54.36 73.41,54.36 73.91,54.86 83.57,54.86 84.33,54.1 v84.33,52.83
PHOTO_SIDE_R  (via drill 0.6)
  Top 0.254: STM1.20 63.72,54.14 v62.99,54.86
  Top 0.305: PHOTO_SIDE_R.E 87.42,32 R22.2
  Bottom 0.254: PHOTO_SIDE_R.E 83.57,32 83.06,32.51 83.06,48.51 82.3,49.28 66.04,49.28 65.28,50.04 65.28,54.36 64.77,54.86 v62.99,54.86
SW1  (via drill 0.6 pad 0.3)
  Top 0.254: STM1.27 60.22,48.49 58.42,50.29 58.42,55.63 57.91,56.13 v51.82,56.13 | 45.47,57.15 45.47,61.47 44.96,61.98 44.2,61.98 43.69,62.48 43.69,65.02 42.93,65.79 19.81,65.79 17.53,68.07 9.52,68.07 S1.2 | v46.48,57.15 45.47,57.15 | 45.47,57.15 43.94,57.15 43.94,56.69 R8.1
  Top 0.61: S1.1 S1.2
  Bottom 0.254: v51.82,56.13 51.31,56.13 50.8,56.64 46.99,56.64 v46.48,57.15
SW2  (via drill 0.6, 0.6 pad 0.3)
  Top 0.254: STM1.28 59.72,48.23 57.91,50.04 57.91,54.1 57.4,54.61 v51.82,54.61 | S2.2 9.23,57.06 9.64,56.66 R9.1 40.71,55.05 39.77,54.1 v37.59,54.1
  Top 0.61: S2.1 S2.2
  Bottom 0.254: v51.82,54.61 51.31,55.12 38.61,55.12 v37.59,54.1
SWDCLK  (via drill 0.6 pad 0.3)
  Top 0.254: STM1.49 57.72,26.1 v58.17,25.65
  Bottom 0.254: v58.17,25.65 58.17,14.22 SWD.3
SWDIO  (via drill 0.6 pad 0.3)
  Top 0.254: STM1.46 56.6,38.4 56.9,38.1 v56.9,24.64
  Bottom 0.254: v56.9,24.64 56.9,22.1 55.37,20.57 SWD.2
UI_LED  (via drill 0.6 pad 0.3)
  Top 0.254: STM1.53 59.72,37.06 v58.93,37.85 | v81.03,37.85 79.1,37.85 IC1.7
  Bottom 0.254: v58.93,37.85 v81.03,37.85
USART_RX  (via drill 0.6 pad 0.3)
  Top 0.254: STM1.43 57.17,39.9 57.4,40.13 57.4,45.47 56.9,45.97 53.59,45.97 53.34,46.23 53.34,47.75 v52.32,48.77
  Bottom 0.254: v52.32,48.77 53.34,49.78 53.34,61.98 53.85,62.48 59.94,62.48 60.45,62.99 BT.2
USART_TX  (via drill 0.6 pad 0.3)
  Top 0.254: STM1.42 56.65,40.4 56.9,40.64 56.9,45.21 56.64,45.47 52.07,45.47 51.82,45.72 v51.82,47.24
  Bottom 0.254: v51.82,47.24 52.58,47.24 53.85,48.51 53.85,61.21 54.36,61.72 62.48,61.72 62.99,62.23 BT.1
VBAT  (via drill 0.6, 0.6 pad 0.3)
  Top 0.254: STM1.26 60.72,48.76 58.93,50.55 58.93,57.4 58.67,57.66 v51.82,57.66 | v36.07,55.63 20.03,55.63 R6.1
  Top 0.305: R7.2 R6.1
  Bottom 0.254: v51.82,57.66 47.75,57.66 46.99,58.42 36.83,58.42 36.07,57.66 v36.07,55.63
VCC
  Top 0.406: IC2.13 IC2.14 33.1,34.54 33.02,34.54 | IC2.24 29.25,41.19 29.21,41.15
  Top 0.61: SW_POWER.3 2.79,17.86 2.79,20 C9.+ 2.94,22.3 C10.1 2.81,24.52 U$2.1 | U$2.1 1.5,24.91 1.02,25.4 1.02,49.78 2.03,50.8 19.3,50.8 | 19.3,50.8 28.45,50.8 29.21,50.04 29.21,46.5 C18.+ 29.19,45.47 C20.1 29.19,41.24 29.25,41.19 | 29.21,41.15 29.21,35.31 29.97,34.54 33.02,34.54 | U$2.6 4.95,28.83 3.68,27.56 U$2.2 U$2.1 | R6.2 19.3,50.8
VEE
  Top 0.61: BAT.1 SW_POWER.2